# Altium schematic sheet 1-POWER.SchDoc
size A2; SheetNumber: 1; SheetTotal: 5
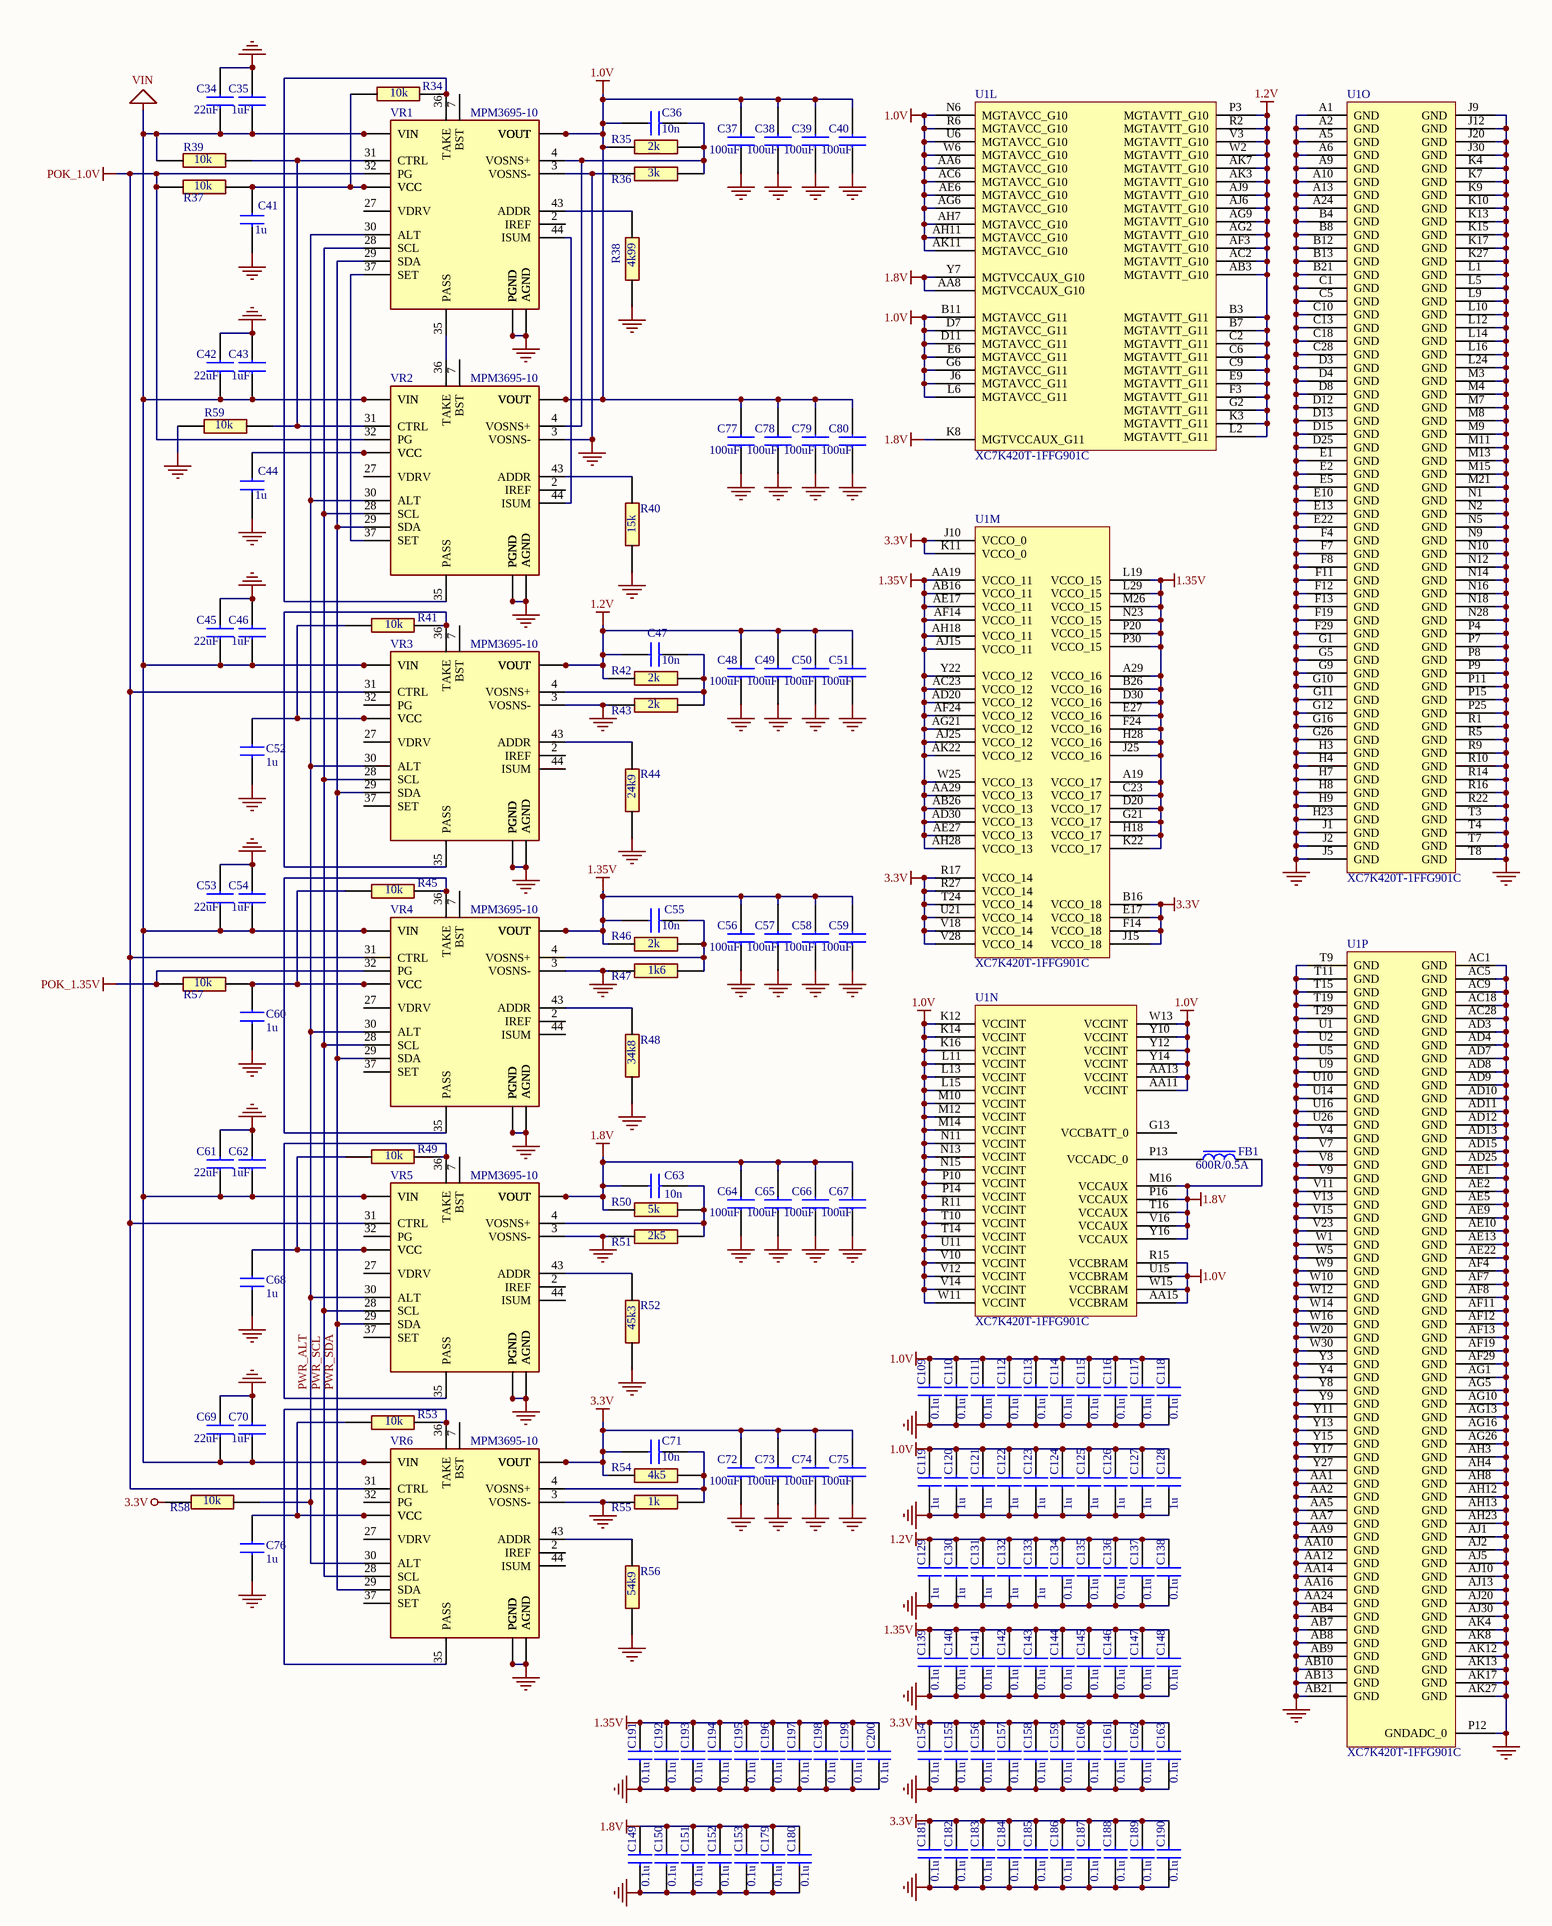
[diagram p0: 1-POWER.SchDoc]

## Parts
C34  22uF  [CAPC3225X280N]
C35  1uF  [CAPC3225X280N]
C36  10n  [SMD0402]
C37  100uF  [CAPC3225X280N]
C38  100uF  [CAPC3225X280N]
C39  100uF  [CAPC3225X280N]
C40  100uF  [CAPC3225X280N]
C41  1u  [SMD0402]
C42  22uF  [CAPC3225X280N]
C43  1uF  [CAPC3225X280N]
C44  1u  [SMD0402]
C45  22uF  [CAPC3225X280N]
C46  1uF  [CAPC3225X280N]
C47  10n  [SMD0402]
C48  100uF  [CAPC3225X280N]
C49  100uF  [CAPC3225X280N]
C50  100uF  [CAPC3225X280N]
C51  100uF  [CAPC3225X280N]
C52  1u  [SMD0402]
C53  22uF  [CAPC3225X280N]
C54  1uF  [CAPC3225X280N]
C55  10n  [SMD0402]
C56  100uF  [CAPC3225X280N]
C57  100uF  [CAPC3225X280N]
C58  100uF  [CAPC3225X280N]
C59  100uF  [CAPC3225X280N]
C60  1u  [SMD0402]
C61  22uF  [CAPC3225X280N]
C62  1uF  [CAPC3225X280N]
C63  10n  [SMD0402]
C64  100uF  [CAPC3225X280N]
C65  100uF  [CAPC3225X280N]
C66  100uF  [CAPC3225X280N]
C67  100uF  [CAPC3225X280N]
C68  1u  [SMD0402]
C69  22uF  [CAPC3225X280N]
C70  1uF  [CAPC3225X280N]
C71  10n  [SMD0402]
C72  100uF  [CAPC3225X280N]
C73  100uF  [CAPC3225X280N]
C74  100uF  [CAPC3225X280N]
C75  100uF  [CAPC3225X280N]
C76  1u  [SMD0402]
C77  100uF  [CAPC3225X280N]
C78  100uF  [CAPC3225X280N]
C79  100uF  [CAPC3225X280N]
C80  100uF  [CAPC3225X280N]
C109  0.1u  [SMD0402]
C110  0.1u  [SMD0402]
C111  0.1u  [SMD0402]
C112  0.1u  [SMD0402]
C113  0.1u  [SMD0402]
C114  0.1u  [SMD0402]
C115  0.1u  [SMD0402]
C116  0.1u  [SMD0402]
C117  0.1u  [SMD0402]
C118  0.1u  [SMD0402]
C119  1u  [SMD0402]
C120  1u  [SMD0402]
C121  1u  [SMD0402]
C122  1u  [SMD0402]
C123  1u  [SMD0402]
C124  1u  [SMD0402]
C125  1u  [SMD0402]
C126  1u  [SMD0402]
C127  1u  [SMD0402]
C128  1u  [SMD0402]
C129  1u  [SMD0402]
C130  1u  [SMD0402]
C131  1u  [SMD0402]
C132  1u  [SMD0402]
C133  1u  [SMD0402]
C134  0.1u  [SMD0402]
C135  0.1u  [SMD0402]
C136  0.1u  [SMD0402]
C137  0.1u  [SMD0402]
C138  0.1u  [SMD0402]
C139  0.1u  [SMD0402]
C140  0.1u  [SMD0402]
C141  0.1u  [SMD0402]
C142  0.1u  [SMD0402]
C143  0.1u  [SMD0402]
C144  0.1u  [SMD0402]
C145  0.1u  [SMD0402]
C146  0.1u  [SMD0402]
C147  0.1u  [SMD0402]
C148  0.1u  [SMD0402]
C149  0.1u  [SMD0402]
C150  0.1u  [SMD0402]
C151  0.1u  [SMD0402]
C152  0.1u  [SMD0402]
C153  0.1u  [SMD0402]
C154  0.1u  [SMD0402]
C155  0.1u  [SMD0402]
C156  0.1u  [SMD0402]
C157  0.1u  [SMD0402]
C158  0.1u  [SMD0402]
C159  0.1u  [SMD0402]
C160  0.1u  [SMD0402]
C161  0.1u  [SMD0402]
C162  0.1u  [SMD0402]
C163  0.1u  [SMD0402]
C179  0.1u  [SMD0402]
C180  0.1u  [SMD0402]
C181  0.1u  [SMD0402]
C182  0.1u  [SMD0402]
C183  0.1u  [SMD0402]
C184  0.1u  [SMD0402]
C185  0.1u  [SMD0402]
C186  0.1u  [SMD0402]
C187  0.1u  [SMD0402]
C188  0.1u  [SMD0402]
C189  0.1u  [SMD0402]
C190  0.1u  [SMD0402]
C191  0.1u  [SMD0402]
C192  0.1u  [SMD0402]
C193  0.1u  [SMD0402]
C194  0.1u  [SMD0402]
C195  0.1u  [SMD0402]
C196  0.1u  [SMD0402]
C197  0.1u  [SMD0402]
C198  0.1u  [SMD0402]
C199  0.1u  [SMD0402]
C200  0.1u  [SMD0402]
FB1  600R/0.5A  [SMD0402]
R34  10k  [SMD0402]
R35  2k  [SMD0402]
R36  3k  [SMD0402]
R37  10k  [SMD0402]
R38  4k99  [SMD0402]
R39  10k  [SMD0402]
R40  15k  [SMD0402]
R41  10k  [SMD0402]
R42  2k  [SMD0402]
R43  2k  [SMD0402]
R44  24k9  [SMD0402]
R45  10k  [SMD0402]
R46  2k  [SMD0402]
R47  1k6  [SMD0402]
R48  34k8  [SMD0402]
R49  10k  [SMD0402]
R50  5k  [SMD0402]
R51  2k5  [SMD0402]
R52  45k3  [SMD0402]
R53  10k  [SMD0402]
R54  4k5  [SMD0402]
R55  1k  [SMD0402]
R56  54k9  [SMD0402]
R57  10k  [SMD0402]
R58  10k  [SMD0402]
R59  10k  [SMD0402]
U1  XC7K420T-1FFG901C  [FFG901]  (parts L,M,N,O,P of 16)
VR1  MPM3695-10  [QFN45-MPM3695-10]
VR2  MPM3695-10  [QFN45-MPM3695-10]
VR3  MPM3695-10  [QFN45-MPM3695-10]
VR4  MPM3695-10  [QFN45-MPM3695-10]
VR5  MPM3695-10  [QFN45-MPM3695-10]
VR6  MPM3695-10  [QFN45-MPM3695-10]

## Nets
1.0V: C36.1 C37.1 C38.1 C39.1 C40.1 C77.1 C78.1 C79.1 C80.1 C109.2 C110.2 C111.2 C112.2 C113.2 C114.2 C115.2 C116.2 C117.2 C118.2 C119.2 C120.2 C121.2 C122.2 C123.2 C124.2 C125.2 C126.2 C127.2 C128.2 R35.2 U1.AA6(MGTAVCC_G10) U1.AA11(VCCINT) U1.AA13(VCCINT) U1.AA15(VCCBRAM) U1.AC6(MGTAVCC_G10) U1.AE6(MGTAVCC_G10) U1.AG6(MGTAVCC_G10) U1.AH7(MGTAVCC_G10) U1.AH11(MGTAVCC_G10) U1.AK11(MGTAVCC_G10) U1.B11(MGTAVCC_G11) U1.D7(MGTAVCC_G11) U1.D11(MGTAVCC_G11) U1.E6(MGTAVCC_G11) U1.G6(MGTAVCC_G11) U1.J6(MGTAVCC_G11) U1.K12(VCCINT) U1.K14(VCCINT) U1.K16(VCCINT) U1.L6(MGTAVCC_G11) U1.L11(VCCINT) U1.L13(VCCINT) U1.L15(VCCINT) U1.M10(VCCINT) U1.M12(VCCINT) U1.M14(VCCINT) U1.N6(MGTAVCC_G10) U1.N11(VCCINT) U1.N13(VCCINT) U1.N15(VCCINT) U1.P10(VCCINT) U1.P14(VCCINT) U1.R6(MGTAVCC_G10) U1.R11(VCCINT) U1.R15(VCCBRAM) U1.T10(VCCINT) U1.T14(VCCINT) U1.U6(MGTAVCC_G10) U1.U11(VCCINT) U1.U15(VCCBRAM) U1.V10(VCCINT) U1.V12(VCCINT) U1.V14(VCCINT) U1.W6(MGTAVCC_G10) U1.W11(VCCINT) U1.W13(VCCINT) U1.W15(VCCBRAM) U1.Y10(VCCINT) U1.Y12(VCCINT) U1.Y14(VCCINT) VR1.9(VOUT) VR1.10(VOUT) VR1.11(VOUT) VR1.12(VOUT) VR1.13(VOUT) VR1.14(VOUT) VR1.15(VOUT) VR2.9(VOUT) VR2.10(VOUT) VR2.11(VOUT) VR2.12(VOUT) VR2.13(VOUT) VR2.14(VOUT) VR2.15(VOUT)
1.2V: C47.1 C48.1 C49.1 C50.1 C51.1 C129.2 C130.2 C131.2 C132.2 C133.2 C134.2 C135.2 C136.2 C137.2 C138.2 R42.2 U1.AB3(MGTAVTT_G10) U1.AC2(MGTAVTT_G10) U1.AF3(MGTAVTT_G10) U1.AG2(MGTAVTT_G10) U1.AG9(MGTAVTT_G10) U1.AJ6(MGTAVTT_G10) U1.AJ9(MGTAVTT_G10) U1.AK3(MGTAVTT_G10) U1.AK7(MGTAVTT_G10) U1.B3(MGTAVTT_G11) U1.B7(MGTAVTT_G11) U1.C2(MGTAVTT_G11) U1.C6(MGTAVTT_G11) U1.C9(MGTAVTT_G11) U1.E9(MGTAVTT_G11) U1.F3(MGTAVTT_G11) U1.G2(MGTAVTT_G11) U1.K3(MGTAVTT_G11) U1.L2(MGTAVTT_G11) U1.P3(MGTAVTT_G10) U1.R2(MGTAVTT_G10) U1.V3(MGTAVTT_G10) U1.W2(MGTAVTT_G10) VR3.9(VOUT) VR3.10(VOUT) VR3.11(VOUT) VR3.12(VOUT) VR3.13(VOUT) VR3.14(VOUT) VR3.15(VOUT)
1.8V: C63.1 C64.1 C65.1 C66.1 C67.1 C149.2 C150.2 C151.2 C152.2 C153.2 C179.2 C180.2 FB1.2 R50.2 U1.AA8(MGTVCCAUX_G10) U1.K8(MGTVCCAUX_G11) U1.M16(VCCAUX) U1.P16(VCCAUX) U1.T16(VCCAUX) U1.V16(VCCAUX) U1.Y7(MGTVCCAUX_G10) U1.Y16(VCCAUX) VR5.9(VOUT) VR5.10(VOUT) VR5.11(VOUT) VR5.12(VOUT) VR5.13(VOUT) VR5.14(VOUT) VR5.15(VOUT)
1.35V: C55.1 C56.1 C57.1 C58.1 C59.1 C139.2 C140.2 C141.2 C142.2 C143.2 C144.2 C145.2 C146.2 C147.2 C148.2 C191.2 C192.2 C193.2 C194.2 C195.2 C196.2 C197.2 C198.2 C199.2 C200.2 R46.2 U1.A19(VCCO_17) U1.A29(VCCO_16) U1.AA19(VCCO_11) U1.AA29(VCCO_13) U1.AB16(VCCO_11) U1.AB26(VCCO_13) U1.AC23(VCCO_12) U1.AD20(VCCO_12) U1.AD30(VCCO_13) U1.AE17(VCCO_11) U1.AE27(VCCO_13) U1.AF14(VCCO_11) U1.AF24(VCCO_12) U1.AG21(VCCO_12) U1.AH18(VCCO_11) U1.AH28(VCCO_13) U1.AJ15(VCCO_11) U1.AJ25(VCCO_12) U1.AK22(VCCO_12) U1.B26(VCCO_16) U1.C23(VCCO_17) U1.D20(VCCO_17) U1.D30(VCCO_16) U1.E27(VCCO_16) U1.F24(VCCO_16) U1.G21(VCCO_17) U1.H18(VCCO_17) U1.H28(VCCO_16) U1.J25(VCCO_16) U1.K22(VCCO_17) U1.L19(VCCO_15) U1.L29(VCCO_15) U1.M26(VCCO_15) U1.N23(VCCO_15) U1.P20(VCCO_15) U1.P30(VCCO_15) U1.W25(VCCO_13) U1.Y22(VCCO_12) VR4.9(VOUT) VR4.10(VOUT) VR4.11(VOUT) VR4.12(VOUT) VR4.13(VOUT) VR4.14(VOUT) VR4.15(VOUT)
3.3V: C71.1 C72.1 C73.1 C74.1 C75.1 C154.2 C155.2 C156.2 C157.2 C158.2 C159.2 C160.2 C161.2 C162.2 C163.2 C181.2 C182.2 C183.2 C184.2 C185.2 C186.2 C187.2 C188.2 C189.2 C190.2 R54.2 R58.1 U1.B16(VCCO_18) U1.E17(VCCO_18) U1.F14(VCCO_18) U1.J10(VCCO_0) U1.J15(VCCO_18) U1.K11(VCCO_0) U1.R17(VCCO_14) U1.R27(VCCO_14) U1.T24(VCCO_14) U1.U21(VCCO_14) U1.V18(VCCO_14) U1.V28(VCCO_14) VR6.9(VOUT) VR6.10(VOUT) VR6.11(VOUT) VR6.12(VOUT) VR6.13(VOUT) VR6.14(VOUT) VR6.15(VOUT)
GND: C34.1 C35.1 C37.2 C38.2 C39.2 C40.2 C41.1 C42.1 C43.1 C44.1 C45.1 C46.1 C48.2 C49.2 C50.2 C51.2 C52.1 C53.1 C54.1 C56.2 C57.2 C58.2 C59.2 C60.1 C61.1 C62.1 C64.2 C65.2 C66.2 C67.2 C68.1 C69.1 C70.1 C72.2 C73.2 C74.2 C75.2 C76.1 C77.2 C78.2 C79.2 C80.2 C109.1 C110.1 C111.1 C112.1 C113.1 C114.1 C115.1 C116.1 C117.1 C118.1 C119.1 C120.1 C121.1 C122.1 C123.1 C124.1 C125.1 C126.1 C127.1 C128.1 C129.1 C130.1 C131.1 C132.1 C133.1 C134.1 C135.1 C136.1 C137.1 C138.1 C139.1 C140.1 C141.1 C142.1 C143.1 C144.1 C145.1 C146.1 C147.1 C148.1 C149.1 C150.1 C151.1 C152.1 C153.1 C154.1 C155.1 C156.1 C157.1 C158.1 C159.1 C160.1 C161.1 C162.1 C163.1 C179.1 C180.1 C181.1 C182.1 C183.1 C184.1 C185.1 C186.1 C187.1 C188.1 C189.1 C190.1 C191.1 C192.1 C193.1 C194.1 C195.1 C196.1 C197.1 C198.1 C199.1 C200.1 R36.2 R38.2 R40.2 R43.2 R44.2 R47.2 R48.2 R51.2 R52.2 R55.2 R56.2 R59.2 U1.A1(GND) U1.A2(GND) U1.A5(GND) U1.A6(GND) U1.A9(GND) U1.A10(GND) U1.A13(GND) U1.A24(GND) U1.AA1(GND) U1.AA2(GND) U1.AA5(GND) U1.AA7(GND) U1.AA9(GND) U1.AA10(GND) U1.AA12(GND) U1.AA14(GND) U1.AA16(GND) U1.AA24(GND) U1.AB4(GND) U1.AB7(GND) U1.AB8(GND) U1.AB9(GND) U1.AB10(GND) U1.AB13(GND) U1.AB21(GND) U1.AC1(GND) U1.AC5(GND) U1.AC9(GND) U1.AC18(GND) U1.AC28(GND) U1.AD3(GND) U1.AD4(GND) U1.AD7(GND) U1.AD8(GND) U1.AD9(GND) U1.AD10(GND) U1.AD11(GND) U1.AD12(GND) U1.AD13(GND) U1.AD15(GND) U1.AD25(GND) U1.AE1(GND) U1.AE2(GND) U1.AE5(GND) U1.AE9(GND) U1.AE10(GND) U1.AE13(GND) U1.AE22(GND) U1.AF4(GND) U1.AF7(GND) U1.AF8(GND) U1.AF11(GND) U1.AF12(GND) U1.AF13(GND) U1.AF19(GND) U1.AF29(GND) U1.AG1(GND) U1.AG5(GND) U1.AG10(GND) U1.AG13(GND) U1.AG16(GND) U1.AG26(GND) U1.AH3(GND) U1.AH4(GND) U1.AH8(GND) U1.AH12(GND) U1.AH13(GND) U1.AH23(GND) U1.AJ1(GND) U1.AJ2(GND) U1.AJ5(GND) U1.AJ10(GND) U1.AJ13(GND) U1.AJ20(GND) U1.AJ30(GND) U1.AK4(GND) U1.AK8(GND) U1.AK12(GND) U1.AK13(GND) U1.AK17(GND) U1.AK27(GND) U1.B4(GND) U1.B8(GND) U1.B12(GND) U1.B13(GND) U1.B21(GND) U1.C1(GND) U1.C5(GND) U1.C10(GND) U1.C13(GND) U1.C18(GND) U1.C28(GND) U1.D3(GND) U1.D4(GND) U1.D8(GND) U1.D12(GND) U1.D13(GND) U1.D15(GND) U1.D25(GND) U1.E1(GND) U1.E2(GND) U1.E5(GND) U1.E10(GND) U1.E13(GND) U1.E22(GND) U1.F4(GND) U1.F7(GND) U1.F8(GND) U1.F11(GND) U1.F12(GND) U1.F13(GND) U1.F19(GND) U1.F29(GND) U1.G1(GND) U1.G5(GND) U1.G9(GND) U1.G10(GND) U1.G11(GND) U1.G12(GND) U1.G16(GND) U1.G26(GND) U1.H3(GND) U1.H4(GND) U1.H7(GND) U1.H8(GND) U1.H9(GND) U1.H23(GND) U1.J1(GND) U1.J2(GND) U1.J5(GND) U1.J9(GND) U1.J12(GND) U1.J20(GND) U1.J30(GND) U1.K4(GND) U1.K7(GND) U1.K9(GND) U1.K10(GND) U1.K13(GND) U1.K15(GND) U1.K17(GND) U1.K27(GND) U1.L1(GND) U1.L5(GND) U1.L9(GND) U1.L10(GND) U1.L12(GND) U1.L14(GND) U1.L16(GND) U1.L24(GND) U1.M3(GND) U1.M4(GND) U1.M7(GND) U1.M8(GND) U1.M9(GND) U1.M11(GND) U1.M13(GND) U1.M15(GND) U1.M21(GND) U1.N1(GND) U1.N2(GND) U1.N5(GND) U1.N9(GND) U1.N10(GND) U1.N12(GND) U1.N14(GND) U1.N16(GND) U1.N18(GND) U1.N28(GND) U1.P4(GND) U1.P7(GND) U1.P8(GND) U1.P9(GND) U1.P11(GND) U1.P12(GNDADC_0) U1.P15(GND) U1.P25(GND) U1.R1(GND) U1.R5(GND) U1.R9(GND) U1.R10(GND) U1.R14(GND) U1.R16(GND) U1.R22(GND) U1.T3(GND) U1.T4(GND) U1.T7(GND) U1.T8(GND) U1.T9(GND) U1.T11(GND) U1.T15(GND) U1.T19(GND) U1.T29(GND) U1.U1(GND) U1.U2(GND) U1.U5(GND) U1.U9(GND) U1.U10(GND) U1.U14(GND) U1.U16(GND) U1.U26(GND) U1.V4(GND) U1.V7(GND) U1.V8(GND) U1.V9(GND) U1.V11(GND) U1.V13(GND) U1.V15(GND) U1.V23(GND) U1.W1(GND) U1.W5(GND) U1.W9(GND) U1.W10(GND) U1.W12(GND) U1.W14(GND) U1.W16(GND) U1.W20(GND) U1.W30(GND) U1.Y3(GND) U1.Y4(GND) U1.Y8(GND) U1.Y9(GND) U1.Y11(GND) U1.Y13(GND) U1.Y15(GND) U1.Y17(GND) U1.Y27(GND) VR1.1(AGND) VR1.3(VOSNS-) VR1.5(AGND) VR1.19(PGND) VR1.20(PGND) VR1.21(PGND) VR1.22(PGND) VR1.23(PGND) VR1.24(PGND) VR1.25(PGND) VR1.38(PGND) VR1.39(PGND) VR1.45(AGND) VR2.1(AGND) VR2.3(VOSNS-) VR2.5(AGND) VR2.19(PGND) VR2.20(PGND) VR2.21(PGND) VR2.22(PGND) VR2.23(PGND) VR2.24(PGND) VR2.25(PGND) VR2.38(PGND) VR2.39(PGND) VR2.45(AGND) VR3.1(AGND) VR3.3(VOSNS-) VR3.5(AGND) VR3.19(PGND) VR3.20(PGND) VR3.21(PGND) VR3.22(PGND) VR3.23(PGND) VR3.24(PGND) VR3.25(PGND) VR3.38(PGND) VR3.39(PGND) VR3.45(AGND) VR4.1(AGND) VR4.3(VOSNS-) VR4.5(AGND) VR4.19(PGND) VR4.20(PGND) VR4.21(PGND) VR4.22(PGND) VR4.23(PGND) VR4.24(PGND) VR4.25(PGND) VR4.38(PGND) VR4.39(PGND) VR4.45(AGND) VR5.1(AGND) VR5.3(VOSNS-) VR5.5(AGND) VR5.19(PGND) VR5.20(PGND) VR5.21(PGND) VR5.22(PGND) VR5.23(PGND) VR5.24(PGND) VR5.25(PGND) VR5.38(PGND) VR5.39(PGND) VR5.45(AGND) VR6.1(AGND) VR6.3(VOSNS-) VR6.5(AGND) VR6.19(PGND) VR6.20(PGND) VR6.21(PGND) VR6.22(PGND) VR6.23(PGND) VR6.24(PGND) VR6.25(PGND) VR6.38(PGND) VR6.39(PGND) VR6.45(AGND)
POK_1.0V: R37.2 VR1.32(PG) VR2.32(PG) VR3.31(CTRL) VR4.31(CTRL) VR5.31(CTRL) VR6.31(CTRL)
POK_1.35V: R57.2 VR4.32(PG)
VIN: C34.2 C35.2 C42.2 C43.2 C45.2 C46.2 C53.2 C54.2 C61.2 C62.2 C69.2 C70.2 R39.2 VR1.40(VIN) VR1.41(VIN) VR2.40(VIN) VR2.41(VIN) VR3.40(VIN) VR3.41(VIN) VR4.40(VIN) VR4.41(VIN) VR5.40(VIN) VR5.41(VIN) VR6.40(VIN) VR6.41(VIN)
PWR_ALT: R58.2 VR1.30(ALT) VR2.30(ALT) VR3.30(ALT) VR4.30(ALT) VR5.30(ALT) VR6.30(ALT)
PWR_SCL: VR1.28(SCL) VR2.28(SCL) VR3.28(SCL) VR4.28(SCL) VR5.28(SCL) VR6.28(SCL)
PWR_SDA: VR1.29(SDA) VR2.29(SDA) VR3.29(SDA) VR4.29(SDA) VR5.29(SDA) VR6.29(SDA)
NetC36_2: C36.2 R35.1 R36.1 VR1.4(VOSNS+) VR2.4(VOSNS+)
NetC41_2: C41.2 R34.1 R37.1 VR1.6(VCC) VR1.26(VCC)
NetC44_2: C44.2 VR2.6(VCC) VR2.26(VCC)
NetC47_2: C47.2 R42.1 R43.1 VR3.4(VOSNS+)
NetC52_2: C52.2 R41.1 VR3.6(VCC) VR3.26(VCC)
NetC55_2: C55.2 R46.1 R47.1 VR4.4(VOSNS+)
NetC60_2: C60.2 R45.1 R57.1 VR4.6(VCC) VR4.26(VCC)
NetC63_2: C63.2 R50.1 R51.1 VR5.4(VOSNS+)
NetC68_2: C68.2 R49.1 VR5.6(VCC) VR5.26(VCC)
NetC71_2: C71.2 R54.1 R55.1 VR6.4(VOSNS+)
NetC76_2: C76.2 R53.1 VR6.6(VCC) VR6.26(VCC)
NetFB1_1: FB1.1 U1.P13(VCCADC_0)
NetR34_2: R34.2 VR1.36(TAKE) VR2.35(PASS)
NetR38_1: R38.1 VR1.43(ADDR)
NetR39_1: R39.1 R59.1 VR1.31(CTRL) VR2.31(CTRL)
NetR40_1: R40.1 VR2.43(ADDR)
NetR41_2: R41.2 VR3.35(PASS) VR3.36(TAKE)
NetR44_1: R44.1 VR3.43(ADDR)
NetR45_2: R45.2 VR4.35(PASS) VR4.36(TAKE)
NetR48_1: R48.1 VR4.43(ADDR)
NetR49_2: R49.2 VR5.35(PASS) VR5.36(TAKE)
NetR52_1: R52.1 VR5.43(ADDR)
NetR53_2: R53.2 VR6.35(PASS) VR6.36(TAKE)
NetR56_1: R56.1 VR6.43(ADDR)
NetVR1_35: VR1.35(PASS) VR2.36(TAKE)
NetVR1_37: VR1.37(SET) VR2.37(SET)
NetVR1_44: VR1.44(ISUM) VR2.44(ISUM)

Not connected (* = marked no-connect by the designer): U1 G13(VCCBATT_0); VR1 2(IREF) 7(BST) 8(TP) 16(N/C) 17(N/C) 18(N/C) 27(VDRV) 33(N/C) 34(N/C) 42(N/C); VR2 2(IREF) 7(BST) 8(TP) 16(N/C) 17(N/C) 18(N/C) 27(VDRV) 33(N/C) 34(N/C) 42(N/C); VR3 2(IREF) 7(BST) 8(TP) 16(N/C) 17(N/C) 18(N/C) 27(VDRV) 32(PG) 33(N/C) 34(N/C) 37(SET) 42(N/C) 44(ISUM); VR4 2(IREF) 7(BST) 8(TP) 16(N/C) 17(N/C) 18(N/C) 27(VDRV) 33(N/C) 34(N/C) 37(SET) 42(N/C) 44(ISUM); VR5 2(IREF) 7(BST) 8(TP) 16(N/C) 17(N/C) 18(N/C) 27(VDRV) 32(PG) 33(N/C) 34(N/C) 37(SET) 42(N/C) 44(ISUM); VR6 2(IREF) 7(BST) 8(TP) 16(N/C) 17(N/C) 18(N/C) 27(VDRV) 32(PG) 33(N/C) 34(N/C) 37(SET) 42(N/C) 44(ISUM)

## Library data of the parts
C34 C35 C37-C40 C42 C43 C45 C46 C48-C51 C53 C54 C56-C59 C61 C62 C64-C67 C69 C70 C72-C75 C77-C80 = CAP 3225: Capacitor; Manufacturer_Name: TAIYO YUDEN; Manufacturer_Part_Number: JMK325ABJ107MM-P; Datasheet Link: https://ms.componentsearchengine.com/Datasheets/1/JMK325ABJ107MM-P.pdf; Height: 2.8mm; Arrow Part Number: JMK325ABJ107MM-P; Arrow Price/Stock: https://www.arrow.com/en/products/jmk325abj107mm-p/taiyo-yuden; Mouser Part Number: 963-JMK325ABJ107MM-P; Mouser Price/Stock: https://www.mouser.co.uk/ProductDetail/Taiyo-Yuden/JMK325ABJ107MM-P?qs=EPmvyOv1YlN%2FKJt%252BEENTYA%3D%3D
C36 C41 C44 C47 C52 C55 C60 C63 C68 C71 C76 C109-C154 C156-C163 C179-C181 C183-C200 = CAP 0402: Capacitor
C155 C182 = CAP 0201: Capacitor
FB1 = FERRITE 0402: Ferrite Bead
R34 = RES 0201: Resistor; Height: 0.28mm
R35-R59 = RES 0402: Resistor
U1 = XC7K420T-1FFG901C: Kintex-7 FPGA, 400 User I/Os, 28 GTX, 900-Ball BGA, Speed Grade 1, Commercial Grade, Pb-Free; Manufacturer: Xilinx; GTX: 28; SelectIO HP: 0; SelectIO HR: 380; Speed Grade: -1; DatasheetVersion: v1.12; PackageVersion: Rev 1.8; PackageReference: FFG901; PackageDescription: Flip-Chip BGA, Body 31 x 31 mm, 1.0 mm Pitch; Generic Part Number: XC7K420T; RoHS: Pb-Free; Mounting Technology: Surface Mount; Code_JEDEC: MS-034-AAN-1; PartNumber: XC7K420T-1FFG901C; ComponentLink1Description: Datasheet; ComponentLink1URL: http://www.xilinx.com/support/documentation/data_sheets/ds180_7Series_Overview.pdf; ComponentLink2Description: Package Specification; ComponentLink2URL: http://www.xilinx.com/support/documentation/user_guides/ug475_7Series_Pkg_Pinout.pdf
VR1-VR6 = MPM3695-10: 16V, 10A, Scalable, Ultra-Thin DC/DC Power Module with PMBus